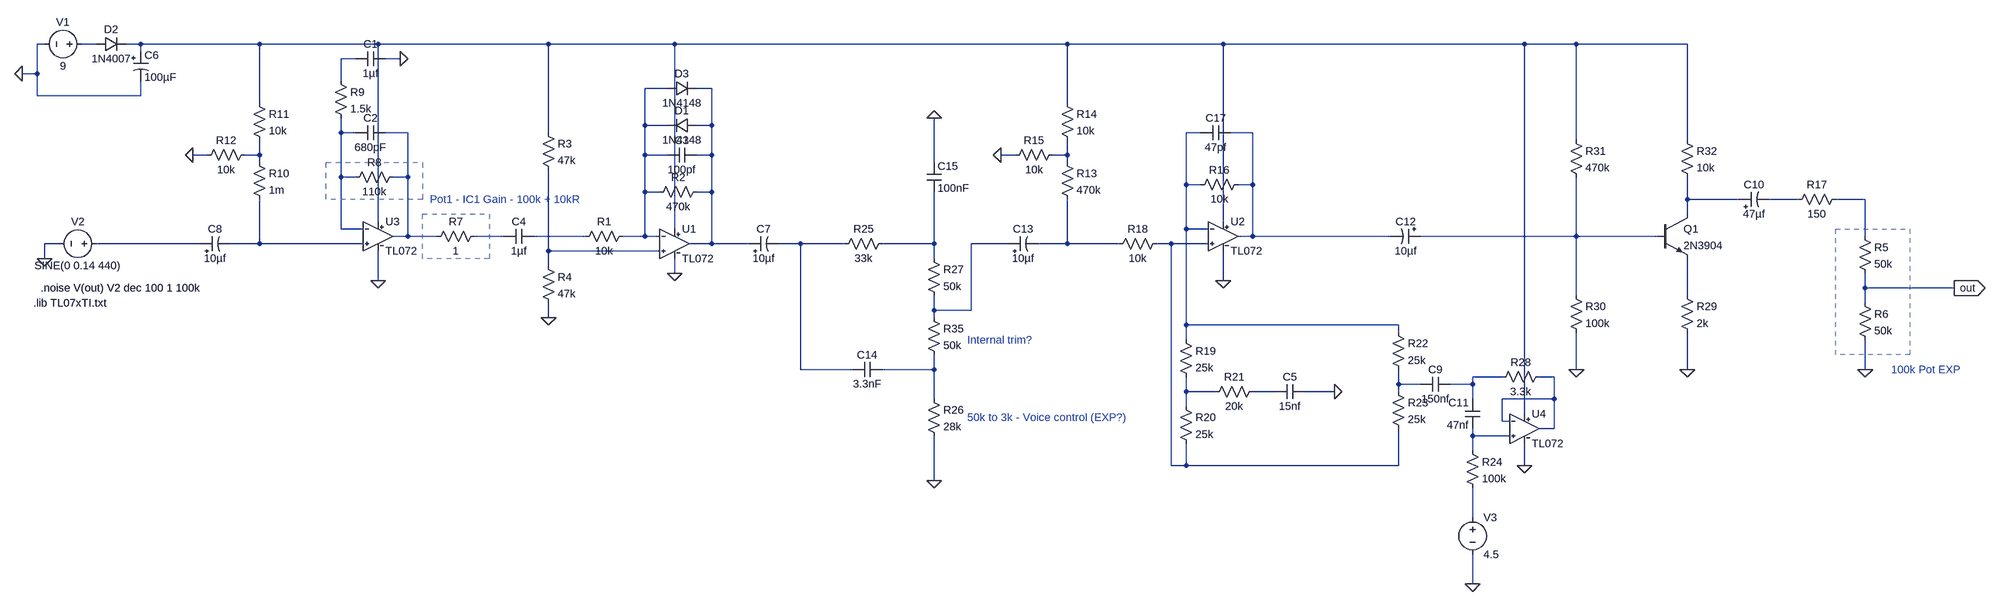
[diagram p0: schematic 7162024_8.asc]
7162024_8.asc, the LTspice schematic file:
Version 4
SHEET 1 5808 1060
WIRE 432 -336 416 -336
WIRE 544 -336 512 -336
WIRE 640 -336 608 -336
WIRE 896 -336 640 -336
WIRE 1152 -336 896 -336
WIRE 1520 -336 1152 -336
WIRE 1792 -336 1520 -336
WIRE 2640 -336 1792 -336
WIRE 2976 -336 2640 -336
WIRE 3648 -336 2976 -336
WIRE 3760 -336 3648 -336
WIRE 4016 -336 3760 -336
WIRE 640 -320 640 -336
WIRE 1104 -304 1072 -304
WIRE 1200 -304 1168 -304
WIRE 416 -272 416 -336
WIRE 416 -272 384 -272
WIRE 1072 -256 1072 -304
WIRE 1776 -240 1728 -240
WIRE 1872 -240 1840 -240
WIRE 416 -224 416 -272
WIRE 640 -224 640 -256
WIRE 640 -224 416 -224
WIRE 896 -208 896 -336
WIRE 2640 -208 2640 -336
WIRE 1728 -160 1728 -240
WIRE 1776 -160 1728 -160
WIRE 1872 -160 1872 -240
WIRE 1872 -160 1840 -160
WIRE 1072 -144 1072 -176
WIRE 1104 -144 1072 -144
WIRE 1216 -144 1168 -144
WIRE 1520 -144 1520 -336
WIRE 2928 -144 2896 -144
WIRE 3040 -144 2992 -144
WIRE 3760 -128 3760 -336
WIRE 4016 -128 4016 -336
WIRE 784 -96 752 -96
WIRE 896 -96 896 -128
WIRE 896 -96 864 -96
WIRE 1728 -96 1728 -160
WIRE 1776 -96 1728 -96
WIRE 1872 -96 1872 -160
WIRE 1872 -96 1840 -96
WIRE 2528 -96 2496 -96
WIRE 2640 -96 2640 -128
WIRE 2640 -96 2608 -96
WIRE 896 -80 896 -96
WIRE 2352 -80 2352 -176
WIRE 2640 -80 2640 -96
WIRE 1072 -48 1072 -144
WIRE 1104 -48 1072 -48
WIRE 1216 -48 1216 -144
WIRE 1216 -48 1184 -48
WIRE 2896 -32 2896 -144
WIRE 2928 -32 2896 -32
WIRE 3040 -32 3040 -144
WIRE 3040 -32 3008 -32
WIRE 1728 -16 1728 -96
WIRE 1760 -16 1728 -16
WIRE 1872 -16 1872 -96
WIRE 1872 -16 1840 -16
WIRE 4016 0 4016 -48
WIRE 4128 0 4016 0
WIRE 4256 0 4192 0
WIRE 4400 0 4336 0
WIRE 4016 32 4016 0
WIRE 1152 48 1152 -336
WIRE 2976 48 2976 -336
WIRE 1072 64 1072 -48
WIRE 1120 64 1072 64
WIRE 1792 64 1792 -336
WIRE 2896 64 2896 -32
WIRE 2944 64 2896 64
WIRE 1216 80 1216 -48
WIRE 1216 80 1184 80
WIRE 1280 80 1216 80
WIRE 1424 80 1360 80
WIRE 1600 80 1488 80
WIRE 1728 80 1728 -16
WIRE 1728 80 1680 80
WIRE 1760 80 1728 80
WIRE 3040 80 3040 -32
WIRE 3040 80 3008 80
WIRE 3360 80 3040 80
WIRE 3760 80 3760 -48
WIRE 3760 80 3424 80
WIRE 3952 80 3760 80
WIRE 4400 80 4400 0
WIRE 464 96 432 96
WIRE 768 96 544 96
WIRE 896 96 896 0
WIRE 896 96 832 96
WIRE 1120 96 896 96
WIRE 1872 96 1872 -16
WIRE 1872 96 1824 96
WIRE 1952 96 1872 96
WIRE 2064 96 2016 96
WIRE 2160 96 2064 96
WIRE 2352 96 2352 -16
WIRE 2352 96 2240 96
WIRE 2512 96 2432 96
WIRE 2640 96 2640 0
WIRE 2640 96 2576 96
WIRE 2752 96 2640 96
WIRE 2864 96 2832 96
WIRE 2944 96 2864 96
WIRE 1520 112 1520 -64
WIRE 1760 112 1520 112
WIRE 432 128 432 96
WIRE 2352 128 2352 96
WIRE 1520 144 1520 112
WIRE 1792 160 1792 128
WIRE 1152 176 1152 112
WIRE 2976 176 2976 112
WIRE 4400 192 4400 160
WIRE 4592 192 4400 192
WIRE 3760 208 3760 80
WIRE 4016 208 4016 128
WIRE 4400 224 4400 192
WIRE 2352 240 2352 208
WIRE 2432 240 2432 96
WIRE 2432 240 2352 240
WIRE 1520 256 1520 224
WIRE 2352 256 2352 240
WIRE 2896 272 2896 64
WIRE 3376 272 2896 272
WIRE 3376 288 3376 272
WIRE 2896 304 2896 272
WIRE 2064 368 2064 96
WIRE 2176 368 2064 368
WIRE 2352 368 2352 336
WIRE 2352 368 2240 368
WIRE 3760 368 3760 288
WIRE 4016 368 4016 288
WIRE 4400 368 4400 304
WIRE 3600 384 3536 384
WIRE 3712 384 3680 384
WIRE 3376 400 3376 368
WIRE 3424 400 3376 400
WIRE 3536 400 3536 384
WIRE 3536 400 3488 400
WIRE 2896 416 2896 384
WIRE 2960 416 2896 416
WIRE 3088 416 3040 416
WIRE 3216 416 3152 416
WIRE 3376 416 3376 400
WIRE 2352 432 2352 368
WIRE 3536 432 3536 400
WIRE 3712 432 3712 384
WIRE 3712 432 3600 432
WIRE 2896 448 2896 416
WIRE 3648 464 3648 -336
WIRE 3600 480 3600 432
WIRE 3616 480 3600 480
WIRE 3712 496 3712 432
WIRE 3712 496 3680 496
WIRE 3536 512 3536 496
WIRE 3616 512 3536 512
WIRE 3536 544 3536 512
WIRE 2864 576 2864 96
WIRE 2896 576 2896 528
WIRE 2896 576 2864 576
WIRE 3376 576 3376 496
WIRE 3376 576 2896 576
WIRE 3648 576 3648 528
WIRE 2352 608 2352 512
WIRE 3536 688 3536 624
WIRE 3536 832 3536 768
FLAG 384 -272 0
FLAG 432 128 0
FLAG 752 -96 0
FLAG 1200 -304 0
FLAG 1152 176 0
FLAG 1792 160 0
FLAG 1520 256 0
FLAG 4400 368 0
FLAG 2496 -96 0
FLAG 2976 176 0
FLAG 4592 192 out
IOPIN 4592 192 Out
FLAG 2352 608 0
FLAG 2352 -176 0
FLAG 3216 416 0
FLAG 3648 576 0
FLAG 3536 832 0
FLAG 4016 368 0
FLAG 3760 368 0
SYMBOL voltage 528 -336 R90
WINDOW 0 -32 56 VBottom 2
WINDOW 3 32 56 VTop 2
WINDOW 123 0 0 Left 0
WINDOW 39 0 0 Left 0
SYMATTR InstName V1
SYMATTR Value 9
SYMBOL diode 544 -320 R270
WINDOW 0 32 32 VTop 2
WINDOW 3 0 32 VBottom 2
SYMATTR InstName D2
SYMATTR Value 1N4007
SYMBOL polcap 624 -320 R0
SYMATTR InstName C6
SYMATTR Value 100µF
SYMBOL voltage 560 96 R90
WINDOW 0 -32 56 VBottom 2
WINDOW 3 32 56 VTop 2
WINDOW 123 0 0 Left 0
WINDOW 39 60 56 VTop 2
SYMATTR InstName V2
SYMATTR Value SINE(0 0.14 440)
SYMBOL TL07x_Series_Opamps\\TL072 1152 16 R0
SYMATTR InstName U3
SYMBOL res 880 -96 R0
SYMATTR InstName R10
SYMATTR Value 1m
SYMBOL res 880 -224 R0
SYMATTR InstName R11
SYMATTR Value 10k
SYMBOL res 880 -112 R90
WINDOW 0 0 56 VBottom 2
WINDOW 3 32 56 VTop 2
SYMATTR InstName R12
SYMATTR Value 10k
SYMBOL polcap 768 112 R270
WINDOW 0 32 32 VTop 2
WINDOW 3 0 32 VBottom 2
SYMATTR InstName C8
SYMATTR Value 10µf
SYMBOL cap 1168 -160 R90
WINDOW 0 0 32 VBottom 2
WINDOW 3 32 32 VTop 2
SYMATTR InstName C2
SYMATTR Value 680pF
SYMBOL TL07x_Series_Opamps\\TL072 1792 32 R0
SYMATTR InstName U1
SYMBOL res 1696 64 R90
WINDOW 0 0 56 VBottom 2
WINDOW 3 32 56 VTop 2
SYMATTR InstName R1
SYMATTR Value 10k
SYMBOL res 1856 -32 R90
WINDOW 0 0 56 VBottom 2
WINDOW 3 32 56 VTop 2
SYMATTR InstName R2
SYMATTR Value 470k
SYMBOL cap 1840 -112 R90
WINDOW 0 0 32 VBottom 2
WINDOW 3 32 32 VTop 2
SYMATTR InstName C3
SYMATTR Value 100pf
SYMBOL res 1504 -160 R0
SYMATTR InstName R3
SYMATTR Value 47k
SYMBOL res 1504 128 R0
SYMATTR InstName R4
SYMATTR Value 47k
SYMBOL polcap 1952 112 R270
WINDOW 0 32 32 VTop 2
WINDOW 3 0 32 VBottom 2
SYMATTR InstName C7
SYMATTR Value 10µf
SYMBOL res 4384 64 R0
SYMATTR InstName R5
SYMATTR Value 50k
SYMBOL res 4384 208 R0
SYMATTR InstName R6
SYMATTR Value 50k
SYMBOL res 1200 -64 R90
WINDOW 0 0 56 VBottom 2
WINDOW 3 32 56 VTop 2
SYMATTR InstName R8
SYMATTR Value 110k
SYMBOL diode 1840 -176 R90
WINDOW 0 0 32 VBottom 2
WINDOW 3 32 32 VTop 2
SYMATTR InstName D1
SYMATTR Value 1N4148
SYMBOL diode 1776 -224 R270
WINDOW 0 32 32 VTop 2
WINDOW 3 0 32 VBottom 2
SYMATTR InstName D3
SYMATTR Value 1N4148
SYMBOL cap 1168 -320 R90
WINDOW 0 0 32 VBottom 2
WINDOW 3 32 32 VTop 2
SYMATTR InstName C1
SYMATTR Value 1µf
SYMBOL res 1376 64 R90
WINDOW 0 0 56 VBottom 2
WINDOW 3 32 56 VTop 2
SYMATTR InstName R7
SYMATTR Value 1
SYMBOL cap 1488 64 R90
WINDOW 0 0 32 VBottom 2
WINDOW 3 32 32 VTop 2
SYMATTR InstName C4
SYMATTR Value 1µf
SYMBOL polcap 4128 16 R270
WINDOW 0 32 32 VTop 2
WINDOW 3 0 32 VBottom 2
SYMATTR InstName C10
SYMATTR Value 47µf
SYMBOL res 4352 -16 R90
WINDOW 0 0 56 VBottom 2
WINDOW 3 32 56 VTop 2
SYMATTR InstName R17
SYMATTR Value 150
SYMBOL res 1056 -272 R0
SYMATTR InstName R9
SYMATTR Value 1.5k
SYMBOL TL07x_Series_Opamps\\TL072 2976 16 R0
SYMATTR InstName U2
SYMBOL res 2624 -96 R0
SYMATTR InstName R13
SYMATTR Value 470k
SYMBOL res 2624 -224 R0
SYMATTR InstName R14
SYMATTR Value 10k
SYMBOL res 2624 -112 R90
WINDOW 0 0 56 VBottom 2
WINDOW 3 32 56 VTop 2
SYMATTR InstName R15
SYMATTR Value 10k
SYMBOL polcap 2512 112 R270
WINDOW 0 32 32 VTop 2
WINDOW 3 0 32 VBottom 2
SYMATTR InstName C13
SYMATTR Value 10µf
SYMBOL cap 2992 -160 R90
WINDOW 0 0 32 VBottom 2
WINDOW 3 32 32 VTop 2
SYMATTR InstName C17
SYMATTR Value 47pf
SYMBOL res 3024 -48 R90
WINDOW 0 0 56 VBottom 2
WINDOW 3 32 56 VTop 2
SYMATTR InstName R16
SYMATTR Value 10k
SYMBOL res 2256 80 R90
WINDOW 0 0 56 VBottom 2
WINDOW 3 32 56 VTop 2
SYMATTR InstName R25
SYMATTR Value 33k
SYMBOL cap 2240 352 R90
WINDOW 0 0 32 VBottom 2
WINDOW 3 32 32 VTop 2
SYMATTR InstName C14
SYMATTR Value 3.3nF
SYMBOL res 2336 416 R0
SYMATTR InstName R26
SYMATTR Value 28k
SYMBOL cap 2336 -80 R0
SYMATTR InstName C15
SYMATTR Value 100nF
SYMBOL res 2336 112 R0
SYMATTR InstName R27
SYMATTR Value 50k
SYMBOL res 2336 240 R0
SYMATTR InstName R35
SYMATTR Value 50k
SYMBOL res 2848 80 R90
WINDOW 0 0 56 VBottom 2
WINDOW 3 32 56 VTop 2
SYMATTR InstName R18
SYMATTR Value 10k
SYMBOL res 2880 288 R0
SYMATTR InstName R19
SYMATTR Value 25k
SYMBOL res 2880 432 R0
SYMATTR InstName R20
SYMATTR Value 25k
SYMBOL res 3056 400 R90
WINDOW 0 0 56 VBottom 2
WINDOW 3 32 56 VTop 2
SYMATTR InstName R21
SYMATTR Value 20k
SYMBOL cap 3152 400 R90
WINDOW 0 0 32 VBottom 2
WINDOW 3 32 32 VTop 2
SYMATTR InstName C5
SYMATTR Value 15nf
SYMBOL res 3360 272 R0
SYMATTR InstName R22
SYMATTR Value 25k
SYMBOL res 3360 400 R0
SYMATTR InstName R23
SYMATTR Value 25k
SYMBOL TL07x_Series_Opamps\\TL072 3648 432 R0
SYMATTR InstName U4
SYMBOL cap 3488 384 R90
WINDOW 0 0 32 VBottom 2
WINDOW 3 32 32 VTop 2
SYMATTR InstName C9
SYMATTR Value 150nf
SYMBOL cap 3552 496 R180
WINDOW 0 24 56 Left 2
WINDOW 3 24 8 Left 2
SYMATTR InstName C11
SYMATTR Value 47nf
SYMBOL res 3520 528 R0
SYMATTR InstName R24
SYMATTR Value 100k
SYMBOL res 3696 368 R90
WINDOW 0 0 56 VBottom 2
WINDOW 3 32 56 VTop 2
SYMATTR InstName R28
SYMATTR Value 3.3k
SYMBOL voltage 3536 672 R0
WINDOW 123 0 0 Left 0
WINDOW 39 0 0 Left 0
SYMATTR InstName V3
SYMATTR Value 4.5
SYMBOL npn 3952 32 R0
SYMATTR InstName Q1
SYMATTR Value 2N3904
SYMBOL res 4000 192 R0
SYMATTR InstName R29
SYMATTR Value 2k
SYMBOL res 3744 192 R0
SYMATTR InstName R30
SYMATTR Value 100k
SYMBOL res 3744 -144 R0
SYMATTR InstName R31
SYMATTR Value 470k
SYMBOL res 4000 -144 R0
SYMATTR InstName R32
SYMATTR Value 10k
SYMBOL polcap 3424 64 R90
WINDOW 0 0 32 VBottom 2
WINDOW 3 32 32 VTop 2
SYMATTR InstName C12
SYMATTR Value 10µf
TEXT 424 192 Left 2 !.noise V(out) V2 dec 100 1 100k
TEXT 408 224 Left 2 !.lib TL07xTI.txt
TEXT 4456 368 Left 2 ;100k Pot EXP
TEXT 1264 0 Left 2 ;Pot1 - IC1 Gain - 100k + 10kR
TEXT 2424 472 Left 2 ;50k to 3k - Voice control (EXP?)
TEXT 2424 304 Left 2 ;Internal trim?
RECTANGLE Normal 4496 336 4336 64 2
RECTANGLE Normal 1248 0 1040 -80 2
RECTANGLE Normal 1392 128 1248 32 2

The netlist it stands for:
* 7162024_8.asc
V1 N001 0 9
D2 N001 N002 1N4007
C6 N002 0 100µF
V2 N018 0 SINE(0 0.14 440)
XU3 N019 N006 N007 N002 0 TL072  ; pins In+ In- OUT V+ V-
R10 N010 N019 1m
R11 N002 N010 10k
R12 N010 0 10k
C8 N018 N019 10µf
C2 N007 N006 680pF
XU1 N025 N004 N005 N002 0 TL072  ; pins In+ In- OUT V+ V-
R1 N004 N016 10k
R2 N005 N004 470k
C3 N005 N004 100pf
R3 N002 N025 47k
R4 N025 0 47k
C7 N005 N020 10µf
R5 N014 out 50k
R6 out 0 50k
R8 N007 N006 110k
D1 N005 N004 1N4148
D3 N004 N005 1N4148
C1 0 N003 1µf
R7 N015 N007 1
C4 N016 N015 1µf
C10 N012 N013 47µf
R17 N014 N013 150
R9 N003 N006 1.5k
XU2 N024 N008 N009 N002 0 TL072  ; pins In+ In- OUT V+ V-
R13 N011 N023 470k
R14 N002 N011 10k
R15 N011 0 10k
C13 N022 N023 10µf
C17 N009 N008 47pf
R16 N009 N008 10k
R25 N021 N020 33k
C14 N027 N020 3.3nF
R26 N027 0 28k
C15 0 N021 100nF
R27 N021 N022 50k
R35 N022 N027 50k
R18 N024 N023 10k
R19 N008 N031 25k
R20 N031 N024 25k
R21 N032 N031 20k
C5 0 N032 15nf
R22 N008 N030 25k
R23 N030 N024 25k
XU4 N033 N029 N029 N002 0 TL072  ; pins In+ In- OUT V+ V-
C9 N028 N030 150nf
C11 N033 N028 47nf
R24 N033 N034 100k
R28 N029 N028 3.3k
V3 N034 0 4.5
Q1 N012 N017 N026 0 2N3904
R29 N026 0 2k
R30 N017 0 100k
R31 N002 N017 470k
R32 N002 N012 10k
C12 N017 N009 10µf
.model D D
.lib standard.dio
.model NPN NPN
.model PNP PNP
.lib standard.bjt
.noise V(out) V2 dec 100 1 100k
.lib TL07xTI.txt
* 100k Pot EXP
* Pot1 - IC1 Gain - 100k + 10kR
* 50k to 3k - Voice control (EXP?)
* Internal trim?
.backanno
.end